# EAGLE design power_supply_board (EAGLE 5.12)
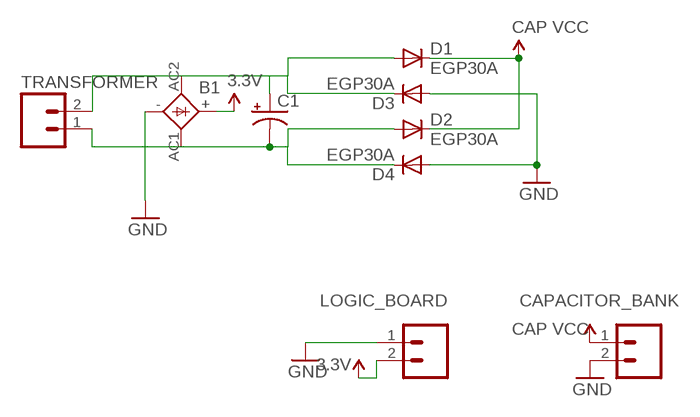
[diagram p0: schematic, sheet 1]

## Parts
B1  FBP1,5  [FBP1,5]
C1  CAP_POLPTH1  [CPOL-RADIAL-100UF-25V]
CAPACITOR_BANK  M02JST-PTH-2  [JST-2-PTH]
D1  EGP30A  [DO201-15]
D2  EGP30A  [DO201-15]
D3  EGP30A  [DO201-15]
D4  EGP30A  [DO201-15]
LOGIC_BOARD  M02JST-PTH-2  [JST-2-PTH]
TRANSFORMER  M02JST-PTH-2  [JST-2-PTH]

## Nets
3.3V: B1.+ LOGIC_BOARD.2
5V: CAPACITOR_BANK.1 D1.C D2.C ; supply symbol labelled CAP VCC
GND: B1.- CAPACITOR_BANK.2 D3.A D4.A LOGIC_BOARD.1
N$2: B1.AC2(AC1) C1.1(+) D1.A D3.C TRANSFORMER.2
N$4: B1.AC1(AC2) C1.2(-) D2.A D4.C TRANSFORMER.1

## Library data of the parts
B1 = rectifier:FBP1,5: FAGOR RECTIFIER grid 3 x 4 mm
C1 = SparkFun:CAP_POL: Capacitor Polarized These are standard SMD and PTH capacitors. Normally 10uF, 47uF, and 100uF in electrolytic and tantalum varieties. Always verify the external diameter of the through hole cap, it varies with capacity, voltage, and manufacturer. The EIA devices should be standard.
CAPACITOR_BANK LOGIC_BOARD TRANSFORMER = SparkFun:M02: Header 2 Standard 2-pin 0.1" header. Use with straight break away headers (SKU : PRT-00116), right angle break away headers (PRT-00553), swiss pins (PRT-00743), machine pins (PRT-00117), and female headers (PRT-00115). Molex polarized connector foot print use with SKU : PRT-08233 with associated crimp pins and housings.
D1-D4 = diode:EGP30A: DIODE ultra fast-recovery rectifier

## Board
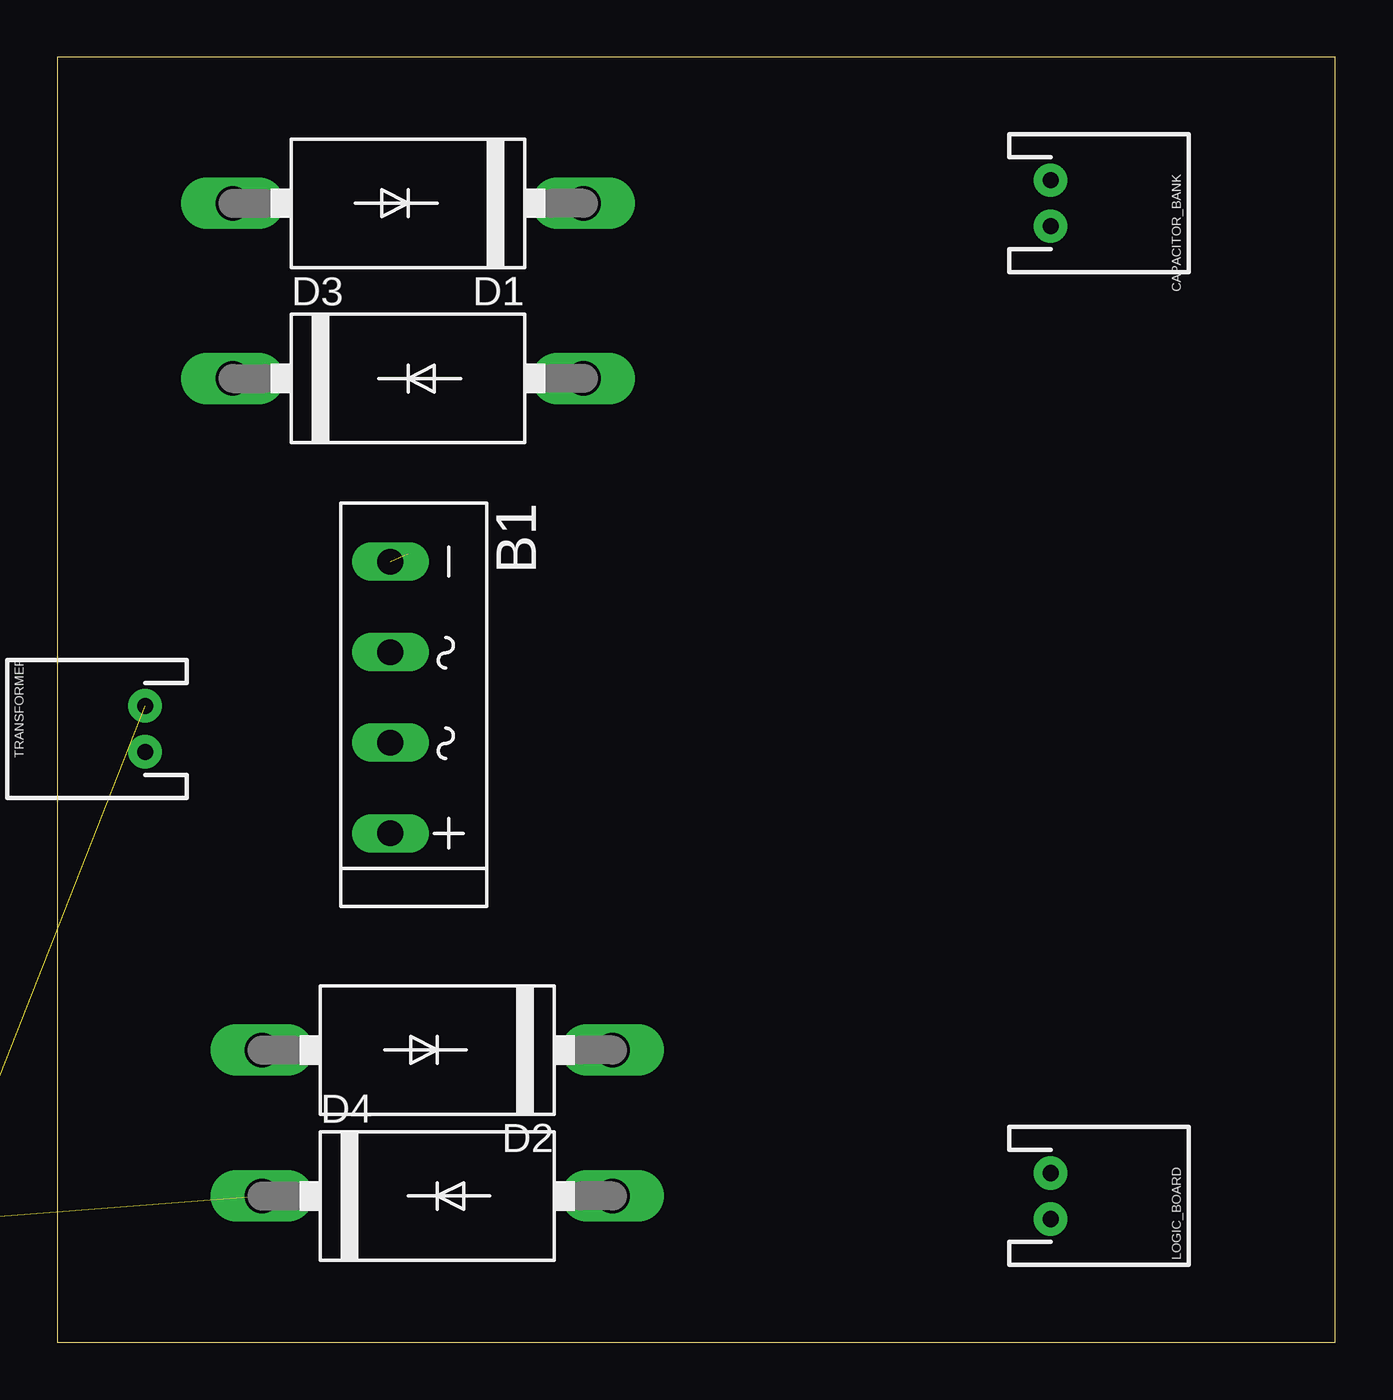
[diagram p1: board, top side]
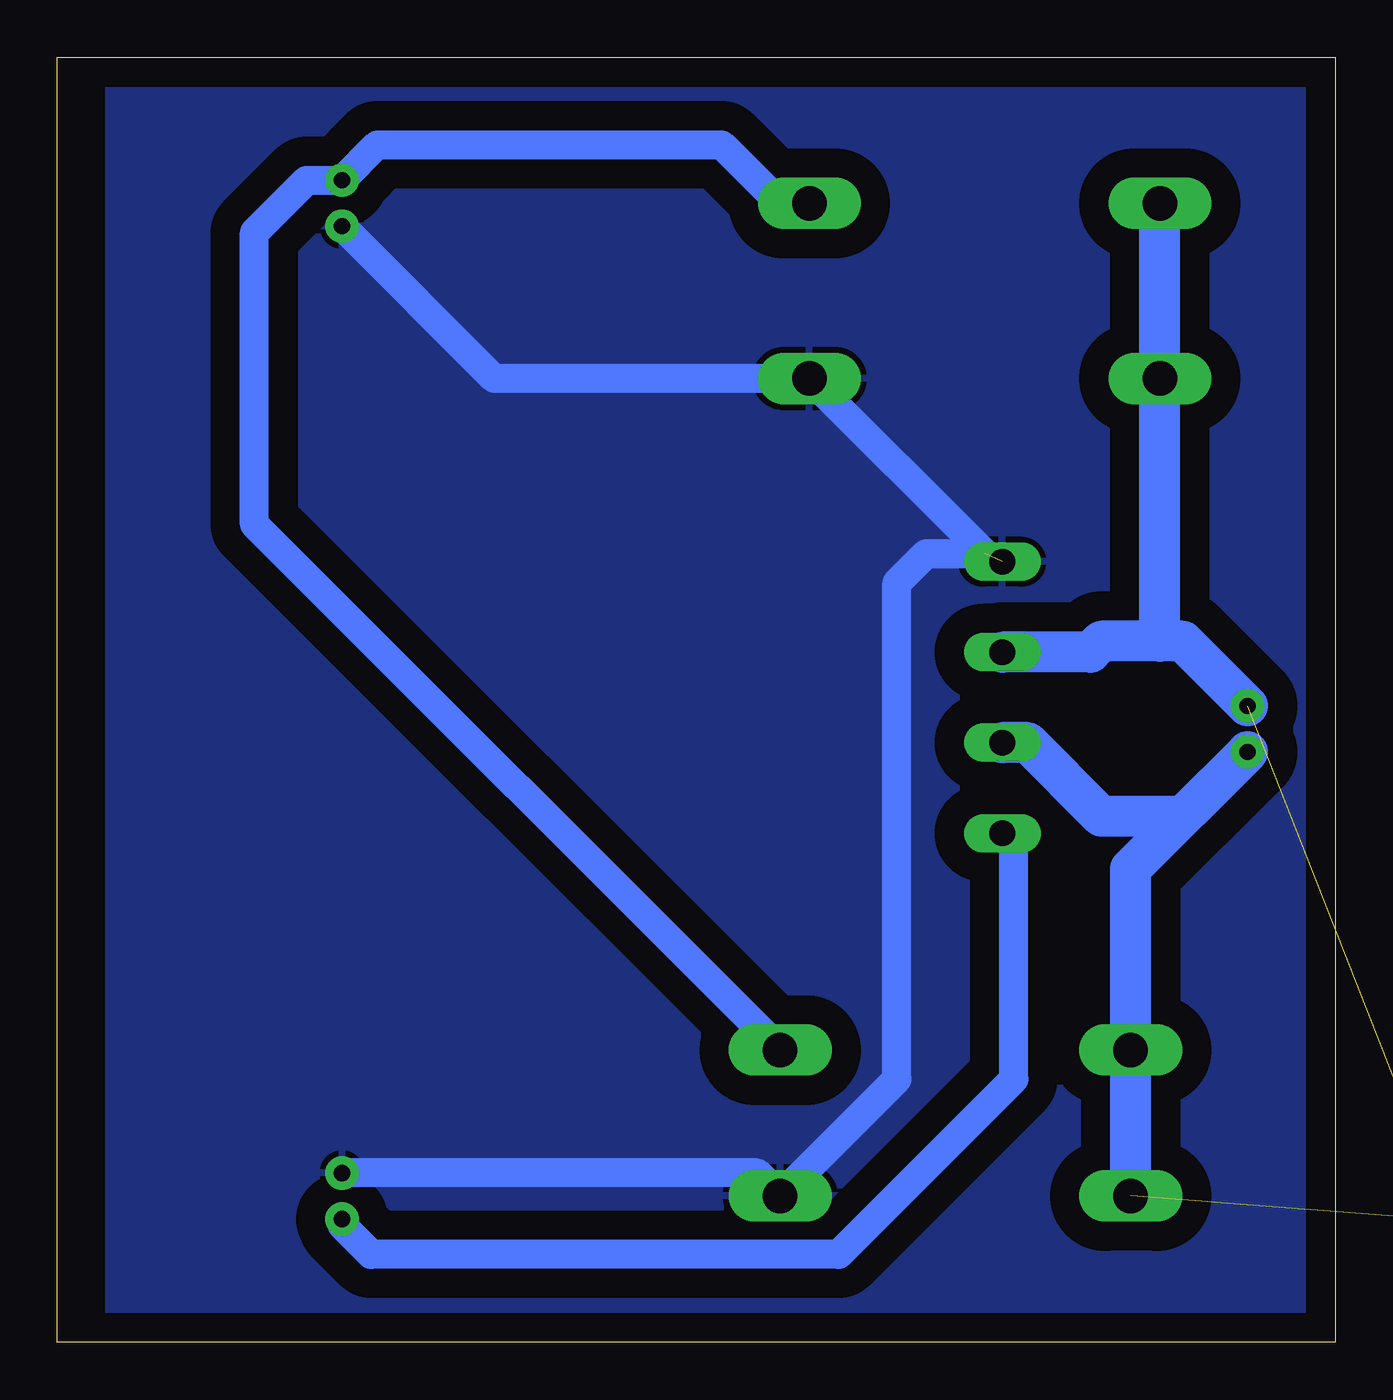
[diagram p2: board, bottom side, seen from below]

Size 55.55 x 55.87 mm. Coordinates in mm from the lower left corner, seen from the top.
Outline: 0,0 55.55,0 55.55,55.87 0,55.87 0,0
Copper layers (1*16): Top 0.035mm / dielectric 1.5mm / Bottom 0.035mm
Design rules "default": minimum track width 10mil, minimum drill 24mil, track to track 8mil, track to pad 8mil, pad to pad 8mil, via to via 8mil, smd to smd 8mil, copper to edge 40mil, drill to drill 8mil, minimum pad ring 10mil, minimum via ring 8mil, stop-mask expansion 4mil, vias tented up to drill 0mil, thermal gap 10mil

### Footprints (pad centres in the part's own frame; a part is rotated, then mirrored left to right if it is on the bottom)
FBP1,5 = drill 1.118 long: + 5.811,-0.77; - -6,-0.77; AC1 1.874,-0.77; AC2 -2.063,-0.77
CPOL-RADIAL-100UF-25V = drill 0.7 pad 1.651 square: 1 1.27,0 | drill 0.7 pad 1.651 round: 2 -1.27,0
JST-2-PTH = drill 0.7 pad 1.448 round: 1 -1,0; 2 1,0
DO201-15 = drill 1.499 long: A 7.62,0; C -7.62,0

### Placement (x,y rotation side)
B1  15.24,27.94 270 top
C1  -6.35,5.08 0 top  (outside the outline)
CAPACITOR_BANK  43.18,49.53 270 top
D1  15.24,49.53 180 top
D2  16.51,12.7 180 top
D3  15.24,41.91 0 top
D4  16.51,6.35 0 top
LOGIC_BOARD  43.18,6.35 270 top
TRANSFORMER  3.81,26.67 90 top

### Tracks (layer width: path | path; a pad name or v marks a point on that pad's centre or on a via)
3.3V
  Bottom 1.27: B1.+ 13.97,21.63 13.97,11.43 21.59,3.81 41.91,3.81 43.18,5.08 LOGIC_BOARD.2
5V
  Bottom 1.27: D1.C 24.13,49.53 26.67,52.07 41.64,52.07 CAPACITOR_BANK.1 44.72,50.53 46.99,48.26 46.99,35.56 D2.C
GND  (1 unrouted)
  Bottom 1.27: CAPACITOR_BANK.2 36.56,41.91 D3.A 15.24,34.29 17.78,34.29 19.05,33.02 19.05,11.43 D4.A 25.13,7.35 LOGIC_BOARD.1
  pour Bottom (isolate 1.27): 1.27,54.61 53.34,54.61 53.34,1.27 1.27,1.27
N$2  (1 unrouted)
  Bottom 1.778: TRANSFORMER.2 6.62,30.48 7.62,30.48 | 7.62,30.48 10.16,30.48 10.64,30 B1.AC2 | D1.A D3.C 7.62,30.48
N$4  (1 unrouted)
  Bottom 1.778: D4.C D2.A 8.89,20.59 TRANSFORMER.1 6.62,22.86 10.16,22.86 13.37,26.07 B1.AC1